# Altium project power_path_control_switchable.PrjPCB
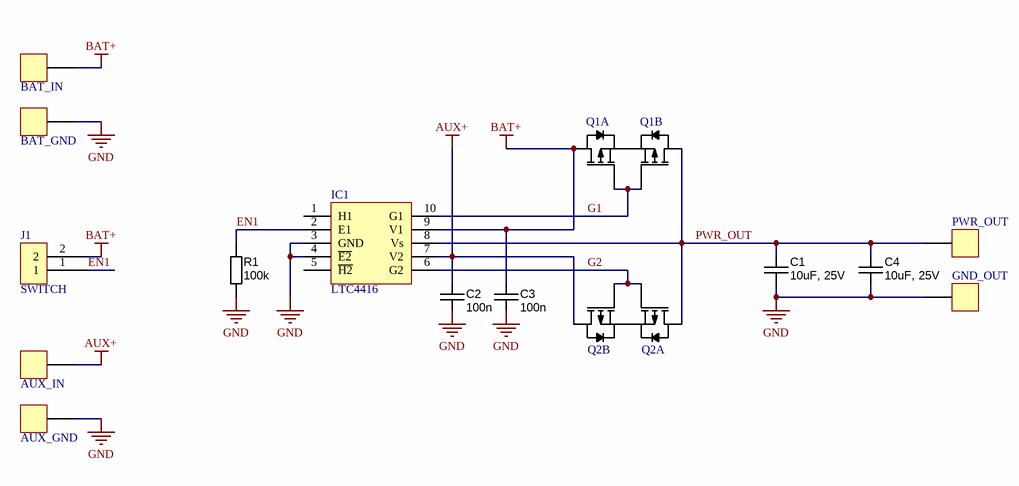
[diagram p0: power_path_control_switchable.SchDoc]
1 sheet, 15 parts. Net scope: global (net labels, ports and power ports of the same name join across sheets).
Board file: power_path_control_switchable.PcbDoc

## Sheet power_path_control_switchable.SchDoc: Name Me
size A4; Organization: SmartStuff OÜ; Address1: Näituse 26, 50407,; Address2: Tartu,; Address3: Estonia; SheetNumber: 1; SheetTotal: 10

### Parts
AUX_GND  HEADER-1  [POWER-PAD-4x3]  (value not drawn)
AUX_IN  HEADER-1  [POWER-PAD-4x3]  (value not drawn)
BAT_GND  HEADER-1  [POWER-PAD-4x3]  (value not drawn)
BAT_IN  HEADER-1  [POWER-PAD-4x3]  (value not drawn)
C1  10uF, 25V  [CAPC3216X180N]
C2  100n  [CAPC1608X90N]
C3  100n  [CAPC1608X90N]
C4  10uF, 25V  [CAPC3216X180N]
GND_OUT  HEADER-1  [POWER-PAD-4x3]  (value not drawn)
IC1  LTC4416  [MSOP-10]
J1  SWITCH  [PADS-2-1020]
PWR_OUT  HEADER-1  [POWER-PAD-4x3]  (value not drawn)
Q1  SI5997DU  [POWERPAK-CHIPFET-DUAL]  (value not drawn)  (parts A,B of 2)
Q2  SI5997DU  [POWERPAK-CHIPFET-DUAL]  (value not drawn)  (parts A,B of 2)
R1  value 100k  [RESC1608X55N]  (hidden comment: Thick Film)

### Nets
AUX+: AUX_IN.1 C2.1 IC1.7(V2) Q2.D2
BAT+: BAT_IN.1 C3.1 IC1.9(V1) J1.2 Q1.D1
GND: AUX_GND.1 BAT_GND.1 C1.2 C2.2 C3.2 C4.2 GND_OUT.1 IC1.3(GND) IC1.4(~{E2}) R1.2
EN1: IC1.2(E1) J1.1 R1.1
G1: IC1.10(G1) Q1.G1 Q1.G2
G2: IC1.6(G2) Q2.G1 Q2.G2
PWR_OUT: C1.1 C4.1 IC1.8(Vs) PWR_OUT.1 Q1.D2 Q2.D1
NetQ1_S1: Q1.S1 Q1.S2
NetQ2_S1: Q2.S1 Q2.S2

Not connected (* = marked no-connect by the designer): IC1 1(H1) 5(~{H2})

### Notes on the sheet
- Size:
- Date:
- A4
- Sheet
- Drawn by:
- of
- Revision:
- SmartStuff OÜ
- Näituse 26
- 50407 Tartu
- Estonia
- File name:

### Library data of the parts
C1 C4 = CAPC_6n8_1206_NP0_50V: Capacitor SMD Cer 6.8nF 5% 50V NP0 1206; Manufacturer 1: TDK Corporation; Manufacturer Part Number 1: C3216C0G1H682J/0.60; Material: Ceramic NP0; SCDType: spec; Tolerance: ±5%; Package / Case: 1206 (3216 metric); Ratings: 25V; Supplier 1: Digi-Key; Supplier Part Number 1: 445-4005-1-ND; Value: 10uF
C2 C3 = CAPC_10n_0603_X7R_50V_10%: Capacitor SMD Cer 10nF 10% 50V X7R 0603; Manufacturer 1: TDK Corporation; Manufacturer Part Number 1: C1608X7R1H103K; Ratings: 50V; X7R; Material: ceramic; SCDType: spec; Value: 10n; Package / Case: 0603 (1608 metric); Tolerance: ±10%; Supplier 1: Digi-Key; Supplier Part Number 1: 445-1311-1-ND; ComponentLink1URL: http://product.tdk.com/capacitor/mlcc/en/documents/mlcc_commercial_general_en.pdf; ComponentLink1Description: http://product.tdk.com/capacitor/mlcc/en/documents/mlcc_commercial_general_en.pdf; Supplier 2: Digi-Key; Supplier Part Number 2: 478-1227-1-ND; Manufacturer 2: AVX Corporation; Manufacturer Part Number 2: 06035C103KAT2A; ComponentLink2URL: http://www.avx.com/docs/Catalogs/cx7r.pdf; ComponentLink2Description: http://www.avx.com/docs/Catalogs/cx7r.pdf
IC1 = LTC4416: PowerPath Controller, 3.6-36V, MSOP-10, LTC4416, Linear Technology; Manufacturer: Analog Devices / Linear Technology; Manufacturer Part Number: LTC4416EMS#PBF; Supply Voltage Range: 3.6V .. 36V; Number of Drivers: 2; Supplier 1: Mouser; Case/Package: MSOP-10; Operating Temperature Range: -40°C .. 85°C; ComponentLink4URL: https://datasheet.ciiva.com/1960/17899-1960765.pdf; ComponentLink4Description: Datasheet; Supplier 2: TME; Supplier Part Number 2: LTC4416EMSPBF; Supplier Part Number 1: 584-LTC4416EMS#PBF
J1 = HEADER-2
Q1 Q2 = SI5997DU: MOSFET, DUAL P-CHANNEL, 30Vin, 6A, 0.054R, SI5997DU-T1-GE3, PowerPAK ChipFET Dual; Manufacturer: Vishay Siliconix; Rds On Max: 54mR; Max Power Dissipation: 10.4W; Drain to Source Voltage (Vdss): -30V; Continuous Drain Current (ID): 5.1A; Gate to Source Voltage (Vgs): 20V; Power Dissipation: 2.3W; Threshold Voltage: -1.2V; Supplier 1: Farnell; Manufacturer Part Number: SI5997DU-T1-GE3; Element Configuration: Dual; ComponentLink1URL: https://datasheet.ciiva.com/11159/si5997du-11159553.pdf; ComponentLink1Description: Datasheet; Supplier 2: Mouser; Supplier Part Number 1: 2056727; Supplier Part Number 2: 78-SI5997DU-T1-GE3
R1 = RES_100K_0603_1%: Resistor SMD chip 100k Ohm 0.1W 1% 0603; Manufacturer 1: Vishay/Dale; Manufacturer Part Number 1: CRCW0603100KFKEA; Ratings: 1/10W; SCDType: spec; Package / Case: 0603 (2012 metric); Supplier 1: Digi-Key; Supplier Part Number 1: 541-100KHCT-ND; Tolerance: ±1%